# Altium schematic sheet CoverSheet.SchDoc: Icarus Flight Computer
size A; Date: 11/30/2022; Revision: PRE RELEASE -- DO NOT USE; SheetNumber: 1; SheetTotal: 13
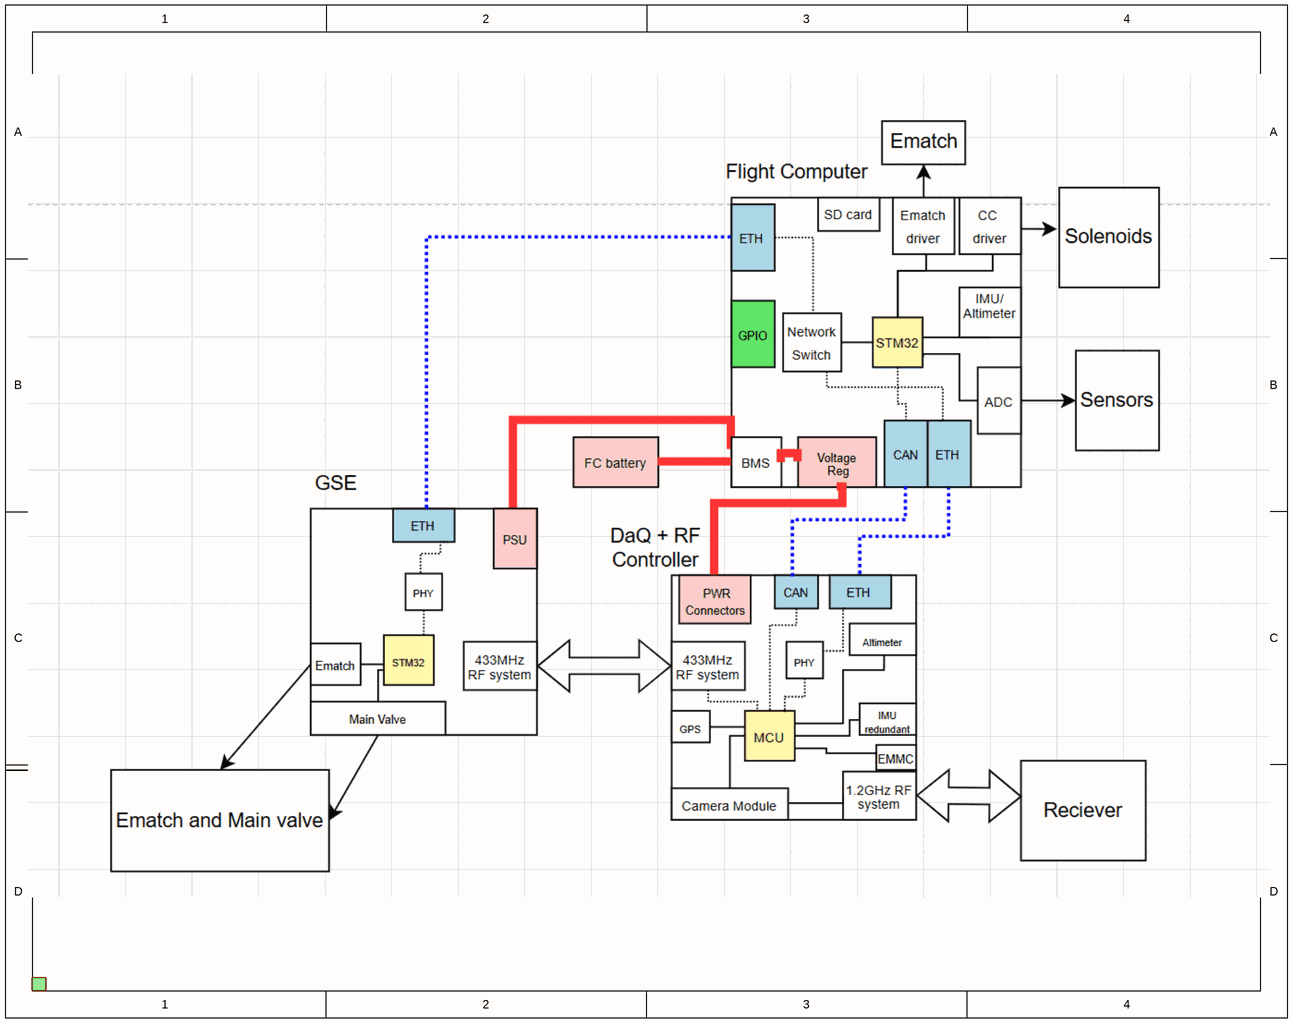
[diagram p0: CoverSheet.SchDoc]

## Sub-sheets
U_TopSheet = TopSheet.SchDoc: no entries